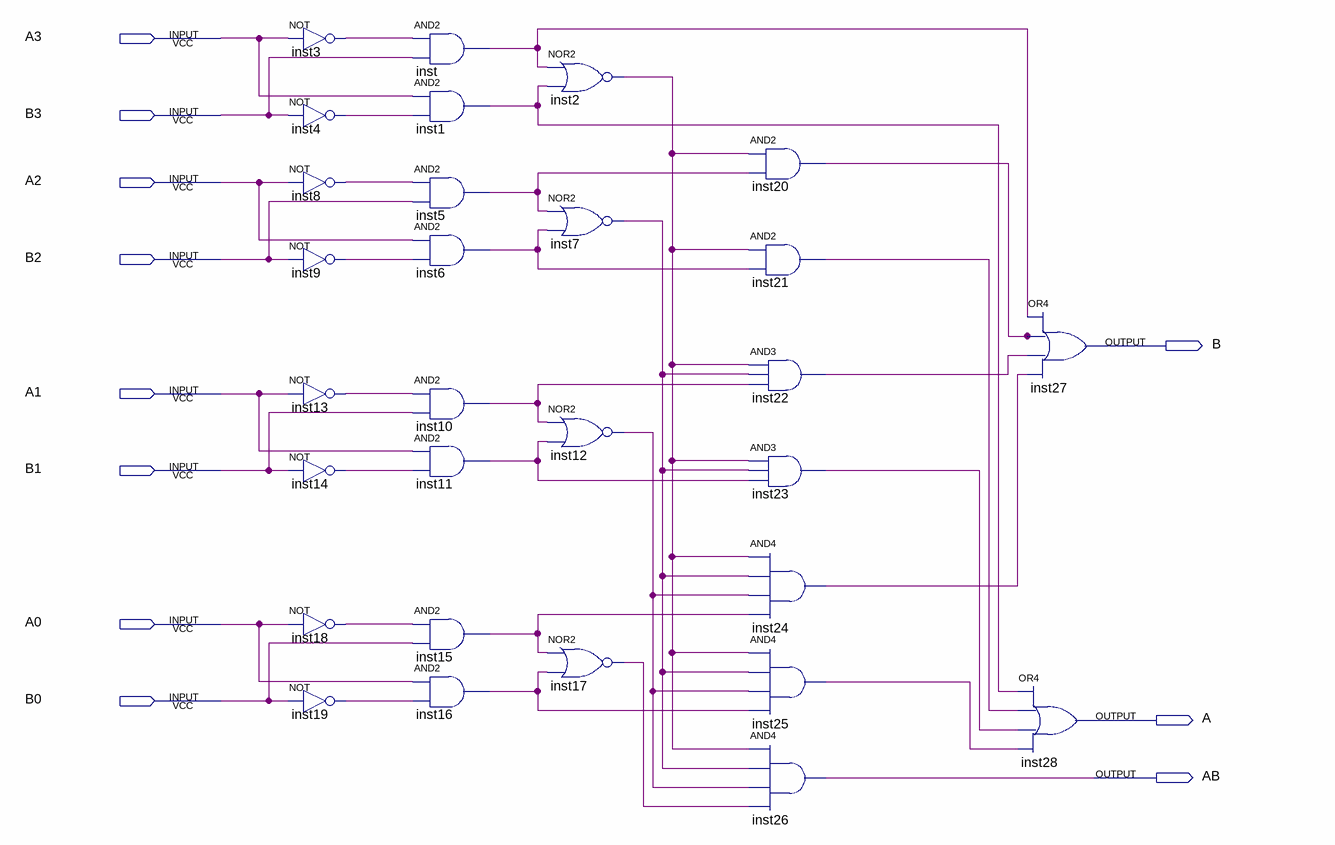
[diagram p0: schematic sheet]
// Quartus schematic FourBitComparator.bdf as structural Verilog: 29 symbols, 11 pins
module FourBitComparator (
  input  A3,
  input  B3,
  input  A2,
  input  B2,
  input  A1,
  input  B1,
  input  A0,
  input  B0,
  output B,
  output A,
  output AB
);

  wire inst1_out, inst2_out, inst3_out, inst4_out, inst5_out, inst6_out, inst7_out, inst8_out, inst9_out,
       inst10_out, inst11_out, inst12_out, inst13_out, inst14_out, inst15_out, inst16_out, inst17_out,
       inst18_out, inst19_out, inst20_out, inst21_out, inst22_out, inst23_out, inst24_out, inst25_out,
       inst_out;

  not inst3 (inst3_out, A3);
  not inst4 (inst4_out, B3);
  not inst8 (inst8_out, A2);
  not inst9 (inst9_out, B2);
  not inst13 (inst13_out, A1);
  not inst14 (inst14_out, B1);
  not inst18 (inst18_out, A0);
  not inst19 (inst19_out, B0);
  and inst (inst_out, inst3_out, B3);
  and inst1 (inst1_out, A3, inst4_out);
  and inst5 (inst5_out, inst8_out, B2);
  and inst6 (inst6_out, A2, inst9_out);
  and inst10 (inst10_out, inst13_out, B1);
  and inst11 (inst11_out, A1, inst14_out);
  and inst15 (inst15_out, inst18_out, B0);
  and inst16 (inst16_out, A0, inst19_out);
  nor inst2 (inst2_out, inst_out, inst1_out);
  nor inst7 (inst7_out, inst5_out, inst6_out);
  nor inst12 (inst12_out, inst10_out, inst11_out);
  nor inst17 (inst17_out, inst15_out, inst16_out);
  and inst20 (inst20_out, inst2_out, inst5_out);
  and inst21 (inst21_out, inst2_out, inst6_out);
  and inst22 (inst22_out, inst2_out, inst7_out, inst10_out);
  and inst23 (inst23_out, inst2_out, inst7_out, inst11_out);
  and inst24 (inst24_out, inst2_out, inst7_out, inst12_out, inst15_out);
  and inst25 (inst25_out, inst2_out, inst7_out, inst12_out, inst16_out);
  and inst26 (AB, inst2_out, inst7_out, inst12_out, inst17_out);
  or inst27 (B, inst_out, inst20_out, inst22_out, inst24_out);
  or inst28 (A, inst1_out, inst21_out, inst23_out, inst25_out);
endmodule
